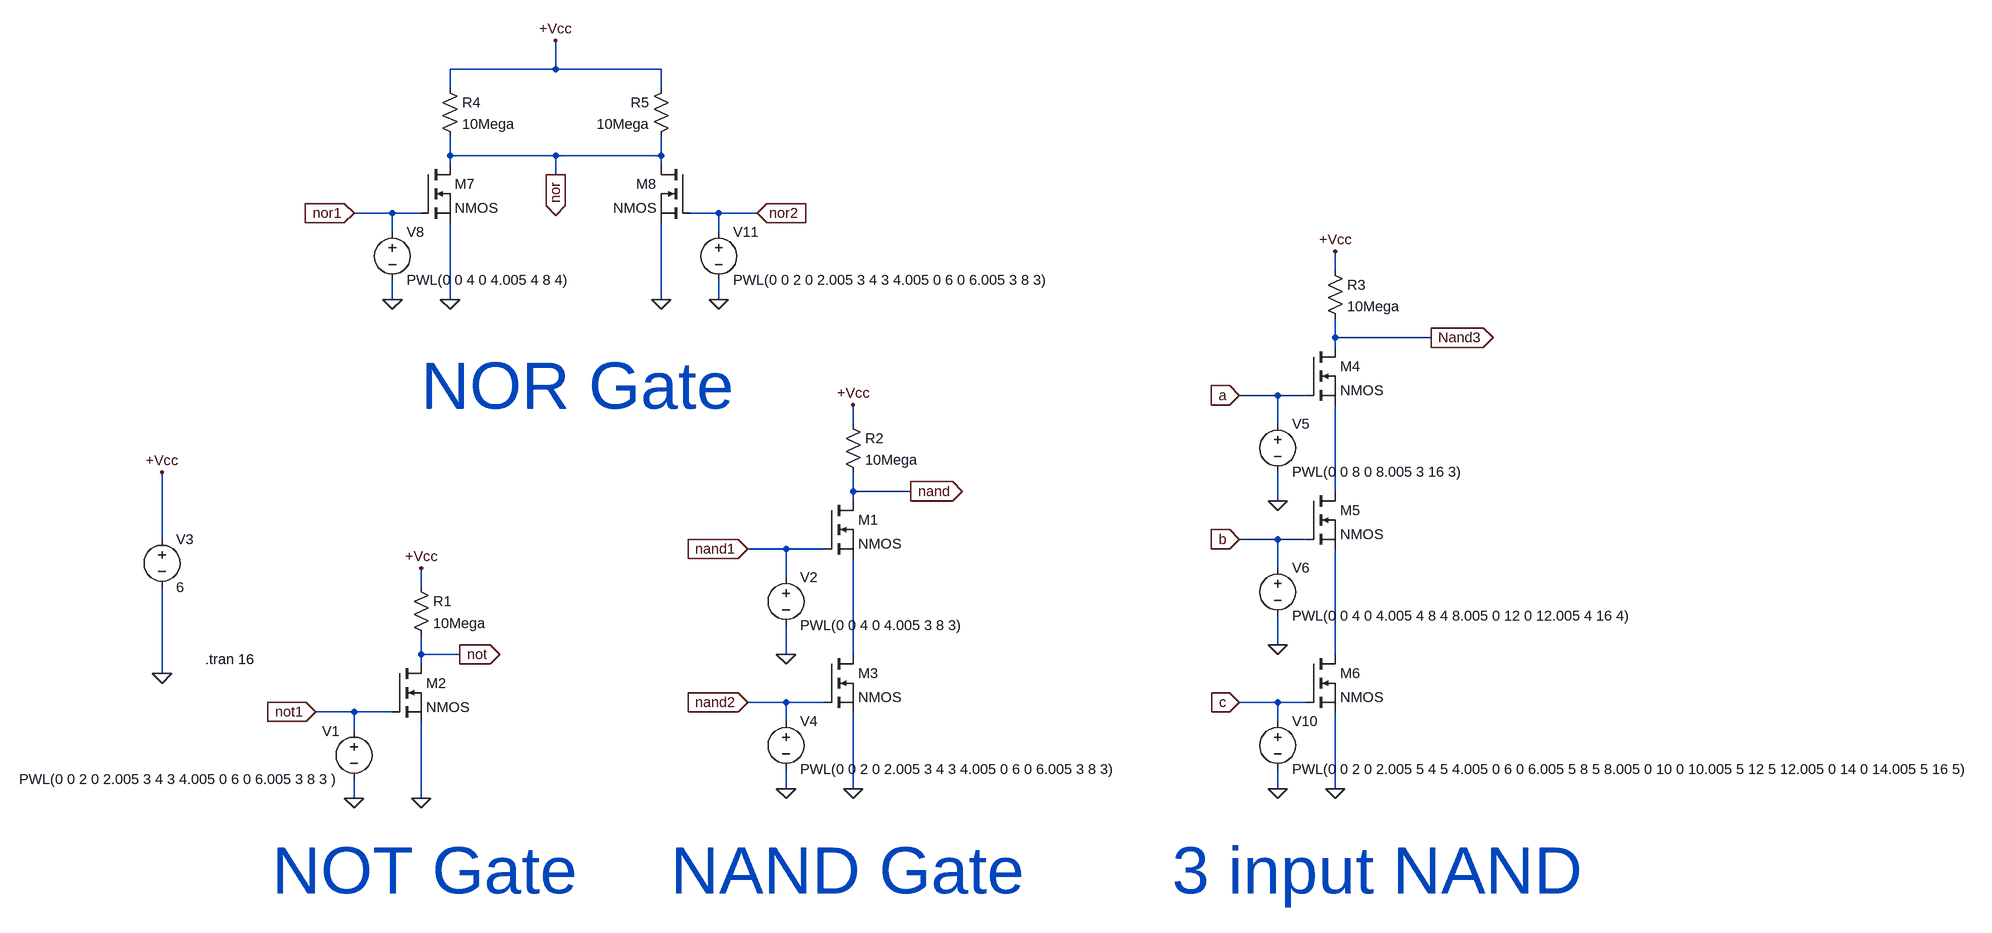
[diagram p0: schematic Basic Gates using NMOS.asc]
Basic Gates using NMOS.asc, the LTspice schematic file:
Version 4
SHEET 1 3744 680
WIRE 464 -960 464 -1008
WIRE 464 -960 288 -960
WIRE 640 -960 464 -960
WIRE 288 -928 288 -960
WIRE 640 -928 640 -960
WIRE 288 -816 288 -848
WIRE 464 -816 288 -816
WIRE 640 -816 640 -848
WIRE 640 -816 464 -816
WIRE 288 -800 288 -816
WIRE 640 -800 640 -816
WIRE 464 -784 464 -816
WIRE 192 -720 128 -720
WIRE 240 -720 192 -720
WIRE 736 -720 688 -720
WIRE 800 -720 736 -720
WIRE 192 -688 192 -720
WIRE 736 -688 736 -720
WIRE 1920 -624 1920 -656
WIRE 192 -576 192 -608
WIRE 288 -576 288 -704
WIRE 640 -576 640 -704
WIRE 736 -576 736 -608
WIRE 1920 -512 1920 -544
WIRE 2080 -512 1920 -512
WIRE 1920 -496 1920 -512
WIRE 1824 -416 1760 -416
WIRE 1872 -416 1824 -416
WIRE 960 -368 960 -400
WIRE 1824 -368 1824 -416
WIRE 960 -256 960 -288
WIRE 1056 -256 960 -256
WIRE 1920 -256 1920 -400
WIRE 960 -240 960 -256
WIRE 1824 -240 1824 -288
WIRE -192 -176 -192 -288
WIRE 1824 -176 1760 -176
WIRE 1872 -176 1824 -176
WIRE 848 -160 784 -160
WIRE 912 -160 848 -160
WIRE 1824 -128 1824 -176
WIRE 848 -112 848 -160
WIRE 240 -96 240 -128
WIRE 1824 0 1824 -48
WIRE 240 16 240 -16
WIRE 304 16 240 16
WIRE 848 16 848 -32
WIRE 960 16 960 -144
WIRE 1920 16 1920 -160
WIRE 240 32 240 16
WIRE -192 48 -192 -96
WIRE 848 96 784 96
WIRE 912 96 848 96
WIRE 1824 96 1760 96
WIRE 1872 96 1824 96
WIRE 128 112 64 112
WIRE 192 112 128 112
WIRE 848 128 848 96
WIRE 1824 128 1824 96
WIRE 128 144 128 112
WIRE 848 240 848 208
WIRE 960 240 960 112
WIRE 1824 240 1824 208
WIRE 1920 240 1920 112
WIRE 128 256 128 224
WIRE 240 256 240 128
FLAG 240 256 0
FLAG 240 -128 +Vcc
FLAG 304 16 not
IOPIN 304 16 Out
FLAG 64 112 not1
IOPIN 64 112 In
FLAG 128 256 0
FLAG -192 -288 +Vcc
FLAG -192 48 0
FLAG 1056 -256 nand
IOPIN 1056 -256 Out
FLAG 960 -400 +Vcc
FLAG 960 240 0
FLAG 848 16 0
FLAG 784 -160 nand1
IOPIN 784 -160 In
FLAG 784 96 nand2
IOPIN 784 96 In
FLAG 848 240 0
FLAG 1920 -656 +Vcc
FLAG 1920 240 0
FLAG 2080 -512 Nand3
IOPIN 2080 -512 Out
FLAG 1824 -240 0
FLAG 1760 -416 a
IOPIN 1760 -416 In
FLAG 1824 0 0
FLAG 1760 -176 b
IOPIN 1760 -176 In
FLAG 1760 96 c
IOPIN 1760 96 In
FLAG 1824 240 0
FLAG 288 -576 0
FLAG 640 -576 0
FLAG 464 -784 nor
IOPIN 464 -784 Out
FLAG 464 -1008 +Vcc
FLAG 128 -720 nor1
IOPIN 128 -720 In
FLAG 192 -576 0
FLAG 800 -720 nor2
IOPIN 800 -720 In
FLAG 736 -576 0
SYMBOL Res 224 -112 R0
SYMATTR InstName R1
SYMATTR Value 10Mega
SYMBOL nmos 192 32 R0
SYMATTR InstName M2
SYMBOL voltage 128 128 M0
SYMATTR InstName V1
SYMATTR Value PWL(0 0 2 0 2.005 3 4 3 4.005 0 6 0 6.005 3 8 3 )
SYMBOL voltage -192 -192 R0
SYMATTR InstName V3
SYMATTR Value 6
SYMBOL Res 944 -384 R0
SYMATTR InstName R2
SYMATTR Value 10Mega
SYMBOL nmos 912 -240 R0
SYMATTR InstName M1
SYMBOL nmos 912 16 R0
SYMATTR InstName M3
SYMBOL voltage 848 -128 R0
SYMATTR InstName V2
SYMATTR Value PWL(0 0 4 0 4.005 3 8 3)
SYMBOL voltage 848 112 R0
SYMATTR InstName V4
SYMATTR Value PWL(0 0 2 0 2.005 3 4 3 4.005 0 6 0 6.005 3 8 3)
SYMBOL Res 1904 -640 R0
SYMATTR InstName R3
SYMATTR Value 10Mega
SYMBOL nmos 1872 -496 R0
SYMATTR InstName M4
SYMBOL nmos 1872 -256 R0
SYMATTR InstName M5
SYMBOL nmos 1872 16 R0
SYMATTR InstName M6
SYMBOL voltage 1824 -384 R0
SYMATTR InstName V5
SYMATTR Value PWL(0 0 8 0 8.005 3 16 3)
SYMBOL voltage 1824 -144 R0
SYMATTR InstName V6
SYMATTR Value PWL(0 0 4 0 4.005 4 8 4 8.005 0 12 0 12.005 4 16 4)
SYMBOL voltage 1824 112 R0
SYMATTR InstName V10
SYMATTR Value PWL(0 0 2 0 2.005 5 4 5 4.005 0 6 0 6.005 5 8 5 8.005 0 10 0 10.005 5 12 5 12.005 0 14 0 14.005 5 16 5)
SYMBOL Res 272 -944 R0
SYMATTR InstName R4
SYMATTR Value 10Mega
SYMBOL Res 656 -944 M0
SYMATTR InstName R5
SYMATTR Value 10Mega
SYMBOL nmos 240 -800 R0
SYMATTR InstName M7
SYMBOL nmos 688 -800 M0
SYMATTR InstName M8
SYMBOL voltage 192 -704 R0
SYMATTR InstName V8
SYMATTR Value PWL(0 0 4 0 4.005 4 8 4)
SYMBOL voltage 736 -704 R0
SYMATTR InstName V11
SYMATTR Value PWL(0 0 2 0 2.005 3 4 3 4.005 0 6 0 6.005 3 8 3)
TEXT -8 376 Left 7 ;NOT Gate
TEXT -120 24 Left 2 !.tran 16
TEXT 656 376 Left 7 ;NAND Gate
TEXT 1648 376 Left 7 ;3 input NAND
TEXT 240 -432 Left 7 ;NOR Gate

The netlist it stands for:
* Basic Gates using NMOS.asc
R1 +Vcc not 10Mega
M2 not not1 0 0 NMOS
V1 not1 0 PWL(0 0 2 0 2.005 3 4 3 4.005 0 6 0 6.005 3 8 3 )
V3 +Vcc 0 6
R2 +Vcc nand 10Mega
M1 nand nand1 N002 N002 NMOS
M3 N002 nand2 0 0 NMOS
V2 nand1 0 PWL(0 0 4 0 4.005 3 8 3)
V4 nand2 0 PWL(0 0 2 0 2.005 3 4 3 4.005 0 6 0 6.005 3 8 3)
R3 +Vcc Nand3 10Mega
M4 Nand3 a N001 N001 NMOS
M5 N001 b N003 N003 NMOS
M6 N003 c 0 0 NMOS
V5 a 0 PWL(0 0 8 0 8.005 3 16 3)
V6 b 0 PWL(0 0 4 0 4.005 4 8 4 8.005 0 12 0 12.005 4 16 4)
V10 c 0 PWL(0 0 2 0 2.005 5 4 5 4.005 0 6 0 6.005 5 8 5 8.005 0 10 0 10.005 5 12 5 12.005 0 14 0 14.005 5 16 5)
R4 +Vcc nor 10Mega
R5 +Vcc nor 10Mega
M7 nor nor1 0 0 NMOS
M8 nor nor2 0 0 NMOS
V8 nor1 0 PWL(0 0 4 0 4.005 4 8 4)
V11 nor2 0 PWL(0 0 2 0 2.005 3 4 3 4.005 0 6 0 6.005 3 8 3)
.model NMOS NMOS
.model PMOS PMOS
.lib standard.mos
* NOT Gate
.tran 16
* NAND Gate
* 3 input NAND
* NOR Gate
.backanno
.end